# Altium project USB-C Explorer.PrjPcb
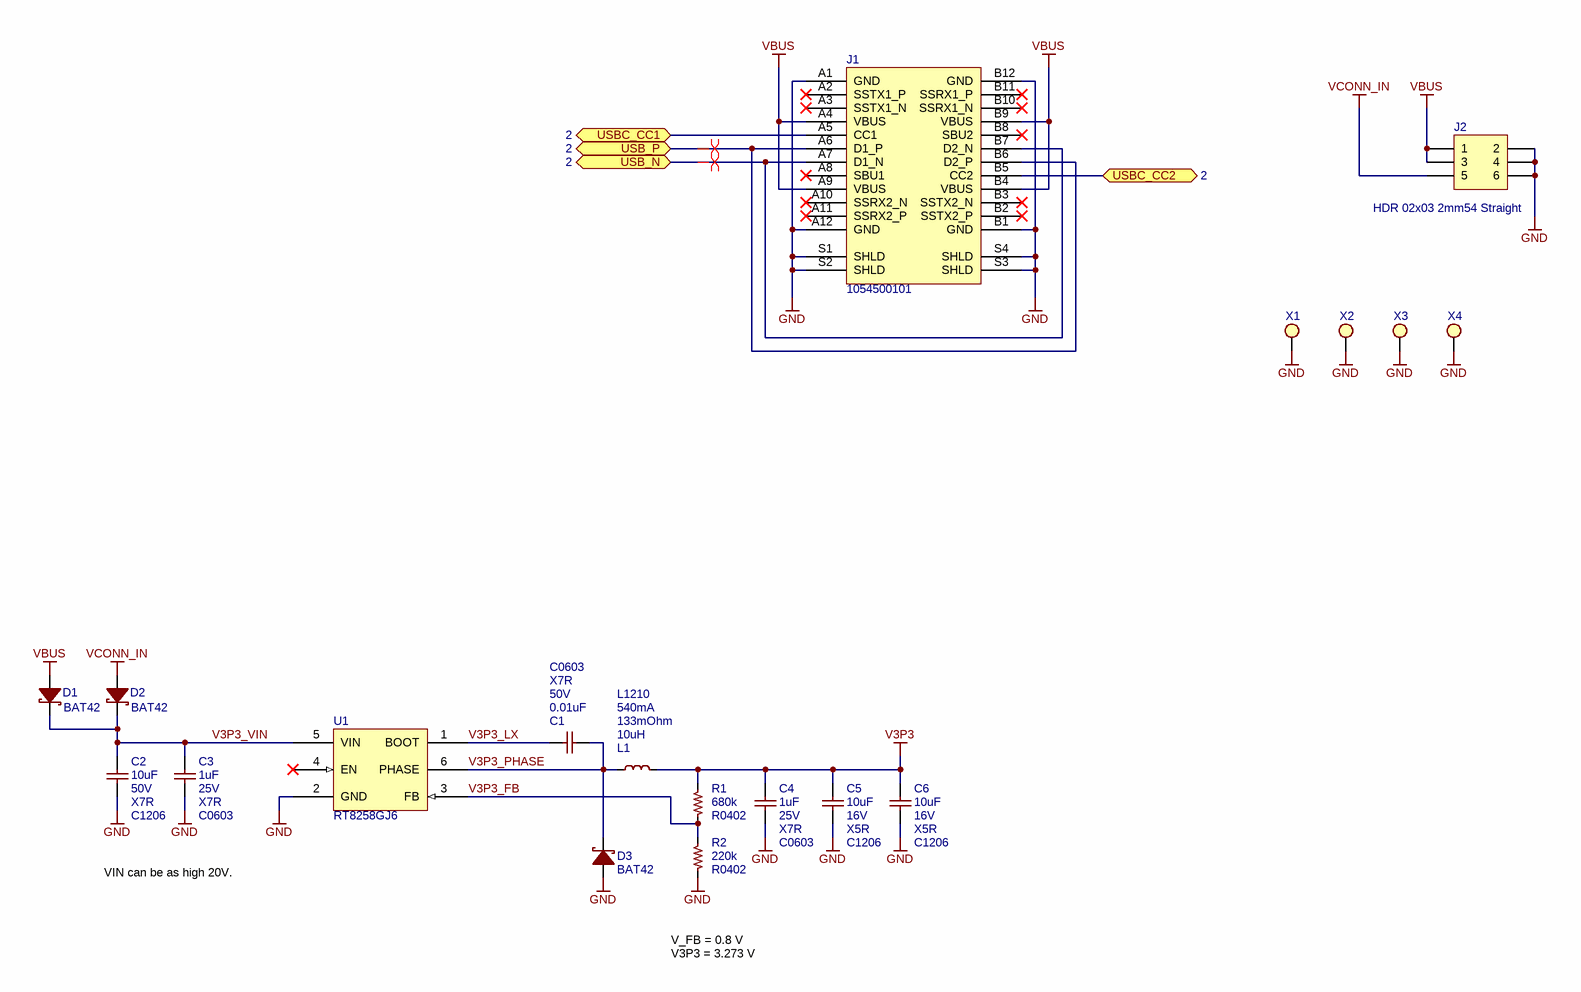
[diagram p0: USB-C.SchDoc]
ProjectDrawnBy: Jason Cerundolo; ProjectFullName: USB-C Explorer; ProjectFullNameNoSpaces: USB-C_Explorer; ProjectName: USB-C Explorer; ProjectRevision: 2
3 sheets, 59 parts. Net scope: flat (ports and power ports of the same name join across sheets).
Board file: USB-C_Explorer.PcbDoc
Sheets:
  USB-C.SchDoc
  MCU.schdoc
  Display.SchDoc

## Sheet USB-C.SchDoc
size B; DocumentFullName: Connectors and Power; Organization: Reclaimer Labs, LLC; Address1: 3652 Beth Ct; Address2: Santa Clara CA 95054; DocumentNumber: 1; SheetNumber: 1; SheetTotal: 3; License: Open Source Hardware - MIT License

### Parts
C1  value 0.01uF  Voltage: 50V  Material: X7R  [C0603]  (hidden comment: MF-CAP-0603-0.01uF)
C2  value 10uF  Voltage: 50V  Material: X7R  [C1206]  (hidden comment: CL31B106KBHNNNE)
C3  value 1uF  Voltage: 25V  Material: X7R  [C0603]  (hidden comment: MF-CAP-0603-1uF)
C4  value 1uF  Voltage: 25V  Material: X7R  [C0603]  (hidden comment: MF-CAP-0603-1uF)
C5  value 10uF  Voltage: 16V  Material: X5R  [C1206]  (hidden comment: MF-CAP-1206-10uF)
C6  value 10uF  Voltage: 16V  Material: X5R  [C1206]  (hidden comment: MF-CAP-1206-10uF)
D1  value BAT42  [SOD-123]  (hidden comment: MF-DIO-SOD123-BAT42)
D2  value BAT42  [SOD-123]  (hidden comment: MF-DIO-SOD123-BAT42)
D3  value BAT42  [SOD-123]  (hidden comment: MF-DIO-SOD123-BAT42)
J1  1054500101  [1054500101]
J2  value HDR 02x03 2mm54 Straight  [CONN_HEADER_02x03_2mm54_Straight]  (hidden comment: MF-CON-2.54mm-2x3)
L1  value 10uH  DCR: 133mOhm  Current: 540mA  [L1210]  (hidden comment: MF-IND-1210-10uH)
R1  value 680k  [R0402]  (hidden comment: MF-RES-0402-680K)
R2  value 220k  [R0402]  (hidden comment: MF-RES-0402-220K)
U1  RT8258GJ6  [SOT23-6]
X1  MTHOLE  (value not drawn)  (no BOM)
X2  MTHOLE  (value not drawn)  (no BOM)
X3  MTHOLE  (value not drawn)  (no BOM)
X4  MTHOLE  (value not drawn)  (no BOM)

### Ports
USB_N (bidir, see 2), USB_P (bidir, see 2), USBC_CC1 (bidir, see 2), USBC_CC2 (bidir, see 2)

### Nets
GND: C2.2(C2) C3.2(C2) C4.2(C2) C5.2(C2) C6.2(C2) D3.2(C2) J1.A1(GND) J1.A12(GND) J1.B1(GND) J1.B12(GND) J1.S1(SHLD) J1.S2(SHLD) J1.S3(SHLD) J1.S4(SHLD) J2.2 J2.4 J2.6 R2.2(R2) U1.2(GND) X1.1 X2.1 X3.1 X4.1
V3P3: C4.1(C1) C5.1(C1) C6.1(C1) L1.2(R2) R1.1(R1)
VBUS: D1.2(C2) J1.A4(VBUS) J1.A9(VBUS) J1.B4(VBUS) J1.B9(VBUS) J2.1 J2.3
VCONN_IN: D2.2(C2) J2.5
USB_N: J1.A7(D1_N) J1.B7(D2_N) ; port USB_N
USB_P: J1.A6(D1_P) J1.B6(D2_P) ; port USB_P
USBC_CC1: J1.A5(CC1) ; port USBC_CC1
USBC_CC2: J1.B5(CC2) ; port USBC_CC2
V3P3_FB: R1.2(R2) R2.1(R1) U1.3(FB)
V3P3_LX: C1.1(C1) U1.1(BOOT)
V3P3_PHASE: C1.2(C2) D3.1(C1) L1.1(R1) U1.6(PHASE)
V3P3_VIN: C2.1(C1) C3.1(C1) D1.1(C1) D2.1(C1) U1.5(VIN)

Not connected (* = marked no-connect by the designer): J1 A2(SSTX1_P)* A3(SSTX1_N)* A8(SBU1)* A10(SSRX2_N)* A11(SSRX2_P)* B2(SSTX2_P)* B3(SSTX2_N)* B8(SBU2)* B10(SSRX1_N)* B11(SSRX1_P)*; U1 4(EN)*

### Layout directives
differential pair: USB_N, USB_P

### Notes on the sheet
- VIN can be as high 20V.
- V_FB = 0.8 V
  V3P3 = 3.273 V
- Project:
- Date:
- Revision:
- Drawn By:
- Document:
- Time:
- Sheet
- of

### Library data of the parts
C1 C3-C6 = CAPACITOR_NP: Manufacturer 1: MacroFab
  C1: Manufacturer Part Number 1: MF-CAP-0603-0.01uF; DisplayFootprint: C0603
  C3 C4: Manufacturer Part Number 1: MF-CAP-0603-1uF; DisplayFootprint: C0603
  C5 C6: Manufacturer Part Number 1: MF-CAP-1206-10uF; DisplayFootprint: C1206
C2 = CAPACITOR_NP: Manufacturer 1: Samsung; Supplier 1: Digi-Key; Supplier Part Number 1: 1276-6767-1-ND; DisplayFootprint: C1206; Manufacturer Part Number 1: CL31B106KBHNNNE
D1 D2 = DIODE_SCHOTTKY: Manufacturer: MacroFab; Manufacturer Part Number 1: MF-DIO-SOD123-BAT42
D3 = DIODE_SCHOTTKY: Manufacturer 1: MacroFab; Manufacturer Part Number 1: MF-DIO-SOD123-BAT42
J1 = USB-C_RECPT: Manufacturer: Molex; Value: 1054500101; Manufacturer Part Number 1: 1054500101
J2 = CONN_HEADER_02x03_2mm54_Straight: Manufacturer 1: MacroFab; Manufacturer Part Number 1: MF-CON-2.54mm-2x3
L1 = INDUCTOR: Manufacturer 1: MacroFab; FootprintDisplay: L1210; Manufacturer Part Number 1: MF-IND-1210-10uH
R1 R2 = RESISTOR: Manufacturer 1: MacroFab; FootprintDisplay: R0402
  R1: Manufacturer Part Number 1: MF-RES-0402-680K
  R2: Manufacturer Part Number 1: MF-RES-0402-220K
U1 = BUCK_RT8258GJ6: Manufacturer 1: Richtek; Value: RT8258GJ6; Supplier 1: Digi-Key; Supplier Part Number 1: 1028-1044-1-ND; Manufacturer Part Number 1: RT8258GJ6

## Sheet MCU.schdoc
size B; DocumentFullName: Microcontroller; Organization: Reclaimer Labs, LLC; Address1: 3652 Beth Ct; Address2: Santa Clara CA 95054; DocumentNumber: 2; SheetNumber: 2; SheetTotal: 3; License: Open Source Hardware - MIT License
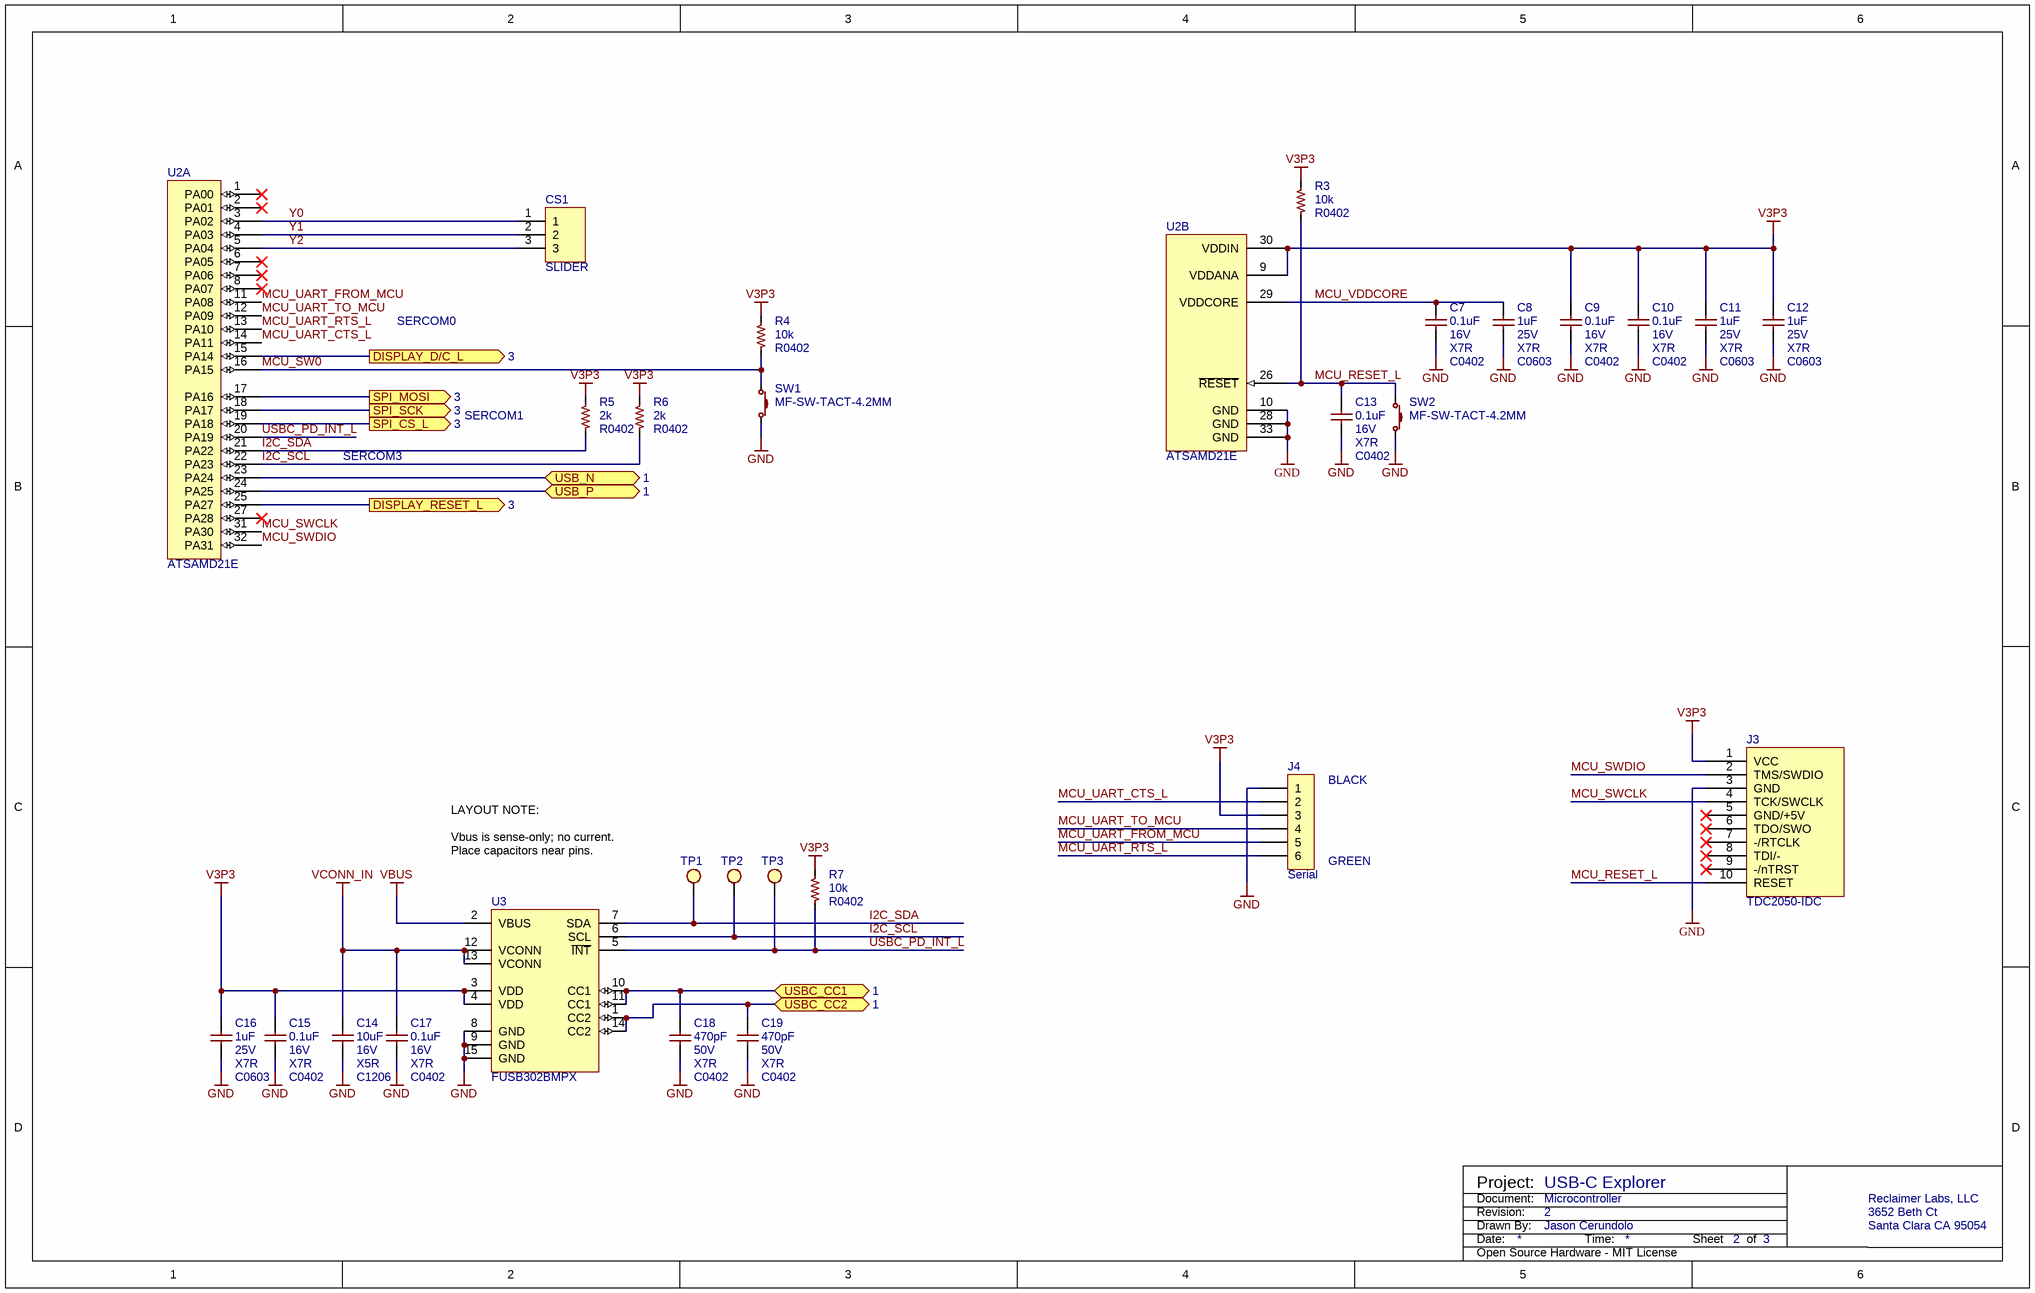
[diagram p1: MCU.schdoc]

### Parts
C7  value 0.1uF  Voltage: 16V  Material: X7R  [C0402]  (hidden comment: MF-CAP-0402-0.1uF)
C8  value 1uF  Voltage: 25V  Material: X7R  [C0603]  (hidden comment: MF-CAP-0603-1uF)
C9  value 0.1uF  Voltage: 16V  Material: X7R  [C0402]  (hidden comment: MF-CAP-0402-0.1uF)
C10  value 0.1uF  Voltage: 16V  Material: X7R  [C0402]  (hidden comment: MF-CAP-0402-0.1uF)
C11  value 1uF  Voltage: 25V  Material: X7R  [C0603]  (hidden comment: MF-CAP-0603-1uF)
C12  value 1uF  Voltage: 25V  Material: X7R  [C0603]  (hidden comment: MF-CAP-0603-1uF)
C13  value 0.1uF  Voltage: 16V  Material: X7R  [C0402]  (hidden comment: MF-CAP-0402-0.1uF)
C14  value 10uF  Voltage: 16V  Material: X5R  [C1206]  (hidden comment: MF-CAP-1206-10uF)
C15  value 0.1uF  Voltage: 16V  Material: X7R  [C0402]  (hidden comment: MF-CAP-0402-0.1uF)
C16  value 1uF  Voltage: 25V  Material: X7R  [C0603]  (hidden comment: MF-CAP-0603-1uF)
C17  value 0.1uF  Voltage: 16V  Material: X7R  [C0402]  (hidden comment: MF-CAP-0402-0.1uF)
C18  value 470pF  Voltage: 50V  Material: X7R  [C0402]  (hidden comment: CL05B471KB5NNNC)
C19  value 470pF  Voltage: 50V  Material: X7R  [C0402]  (hidden comment: CL05B471KB5NNNC)
CS1  SLIDER  [QTOUCH_SLIDER_19x6mm]  (no BOM)
J3  value TDC2050-IDC  [TC2050-IDC-NL]  (hidden comment: DNP)  (no BOM)
J4  value Serial  [CONN_HEADER_01x06_2mm54_Straight]  (hidden comment: DNP)
R3  value 10k  [R0402]  (hidden comment: MF-RES-0402-10K)
R4  value 10k  [R0402]  (hidden comment: MF-RES-0402-10K)
R5  value 2k  [R0402]  (hidden comment: MF-RES-0402-2K)
R6  value 2k  [R0402]  (hidden comment: MF-RES-0402-2K)
R7  value 10k  [R0402]  (hidden comment: MF-RES-0402-10K)
SW1  MF-SW-TACT-4.2MM  [TACT_4.2MM]
SW2  MF-SW-TACT-4.2MM  [TACT_4.2MM]
TP1  TESTPOINT  [TP_1mm]  (value not drawn)  (no BOM)
TP2  TESTPOINT  [TP_1mm]  (value not drawn)  (no BOM)
TP3  TESTPOINT  [TP_1mm]  (value not drawn)  (no BOM)
U2  value ATSAMD21E  [QFN32EP]  (hidden comment: ATSAMD21E17A-MU)  (parts A,B of 2)
U3  FUSB302BMPX  [MLP14]

### Ports
DISPLAY_D/C_L (out, see 3), DISPLAY_RESET_L (out, see 3), SPI_CS_L (out, see 3), SPI_MOSI (out, see 3), SPI_SCK (out, see 3), USB_N (bidir, see 1), USB_P (bidir, see 1), USBC_CC1 (bidir, see 1), USBC_CC2 (bidir, see 1)

### Nets
GND: C7.2(C2) C8.2(C2) C9.2(C2) C10.2(C2) C11.2(C2) C12.2(C2) C13.2(C2) C14.2(C2) C15.2(C2) C16.2(C2) C17.2(C2) C18.2(C2) C19.2(C2) J3.3(GND) J4.1 SW1.2 SW2.2 U2.10(GND) U2.28(GND) U2.33(GND) U3.8(GND) U3.9(GND) U3.15(GND)
V3P3: C9.1(C1) C10.1(C1) C11.1(C1) C12.1(C1) C15.1(C1) C16.1(C1) J3.1(VCC) J4.3 R3.1(R1) R4.1(R1) R5.1(R1) R6.1(R1) R7.1(R1) U2.9(VDDANA) U2.30(VDDIN) U3.3(VDD) U3.4(VDD)
VBUS: U3.2(VBUS)
VCONN_IN: C14.1(C1) C17.1(C1) U3.12(VCONN) U3.13(VCONN)
DISPLAY_D/C_L: U2.15(PA14) ; port DISPLAY_D/C_L
DISPLAY_RESET_L: U2.25(PA27) ; port DISPLAY_RESET_L
I2C_SCL: R6.2(R2) TP2.1 U2.22(PA23) U3.6(SCL)
I2C_SDA: R5.2(R2) TP1.1 U2.21(PA22) U3.7(SDA)
MCU_RESET_L: C13.1(C1) J3.10(RESET) R3.2(R2) SW2.1 U2.26(~{RESET})
MCU_SW0: R4.2(R2) SW1.1 U2.16(PA15)
MCU_SWCLK: J3.4(TCK/SWCLK) U2.31(PA30)
MCU_SWDIO: J3.2(TMS/SWDIO) U2.32(PA31)
MCU_UART_CTS_L: J4.2 U2.14(PA11)
MCU_UART_FROM_MCU: J4.5 U2.11(PA08)
MCU_UART_RTS_L: J4.6 U2.13(PA10)
MCU_UART_TO_MCU: J4.4 U2.12(PA09)
MCU_VDDCORE: C7.1(C1) C8.1(C1) U2.29(VDDCORE)
SPI_CS_L: U2.19(PA18) ; port SPI_CS_L
SPI_MOSI: U2.17(PA16) ; port SPI_MOSI
SPI_SCK: U2.18(PA17) ; port SPI_SCK
USB_N: U2.23(PA24) ; port USB_N
USB_P: U2.24(PA25) ; port USB_P
USBC_CC1: C18.1(C1) U3.10(CC1) U3.11(CC1) ; port USBC_CC1
USBC_CC2: C19.1(C1) U3.1(CC2) U3.14(CC2) ; port USBC_CC2
USBC_PD_INT_L: R7.2(R2) TP3.1 U2.20(PA19) U3.5(~{INT})
Y0: CS1.1 U2.3(PA02)
Y1: CS1.2 U2.4(PA03)
Y2: CS1.3 U2.5(PA04)

Not connected (* = marked no-connect by the designer): J3 5(GND/+5V)* 6(TDO/SWO)* 7(-/RTCLK)* 8(TDI/-)* 9(-/nTRST)*; U2 1(PA00)* 2(PA01)* 6(PA05)* 7(PA06)* 8(PA07)* 27(PA28)*

### Notes on the sheet
- SERCOM0
- SERCOM1
- SERCOM3
- (near J4) BLACK
- LAYOUT NOTE:
  Vbus is sense-only; no current.
  Place capacitors near pins.
- (near J4) GREEN
- Project:
- Date:
- Revision:
- Drawn By:
- Document:
- Time:
- Sheet
- of

### Library data of the parts
C7-C17 = CAPACITOR_NP: Manufacturer 1: MacroFab
  C7 C9 C10 C13 C15 C17: Manufacturer Part Number 1: MF-CAP-0402-0.1uF; DisplayFootprint: C0402
  C8 C11 C12 C16: Manufacturer Part Number 1: MF-CAP-0603-1uF; DisplayFootprint: C0603
  C14: Manufacturer Part Number 1: MF-CAP-1206-10uF; DisplayFootprint: C1206
C18 C19 = CAPACITOR_NP: Manufacturer 1: Samsung; Supplier 1: Digi-Key; Supplier Part Number 1: 1276-1566-1-ND; Manufacturer Part Number 1: CL05B471KB5NNNC; DisplayFootprint: C0402
CS1 = QTOUCH_SLIDER
J3 = TC2050-IDC: Manufacturer Part Number 1: DNP
J4 = CONN_HEADER_01x06_2mm54_Straight: Manufacturer Part Number 1: DNP
R3-R7 = RESISTOR: Manufacturer 1: MacroFab; FootprintDisplay: R0402
  R3 R4 R7: Manufacturer Part Number 1: MF-RES-0402-10K
  R5 R6: Manufacturer Part Number 1: MF-RES-0402-2K
SW1 SW2 = SW_SPST_PB: Manufacturer 1: MacroFab; Value: Push Button; Manufacturer Part Number 1: MF-SW-TACT-4.2MM
U2 = ATSAMD21E: Manufacturer 1: Microchip; Manufacturer Part Number 1: ATSAMD21E17A-MU
U3 = FUSB302B: Manufacturer 1: Fairchild/ON; Value: FUSB302BMPX; Supplier 1: Digi-Key; Supplier Part Number 1: FUSB302BMPXCT-ND; Manufacturer Part Number 1: FUSB302BMPX

## Sheet Display.SchDoc
size B; Organization: Reclaimer Labs, LLC; Address1: 3652 Beth Ct; Address2: Santa Clara CA 95054; DocumentNumber: 3; SheetNumber: 3; SheetTotal: 3; License: Open Source Hardware - MIT License; DocumentFullName: Display
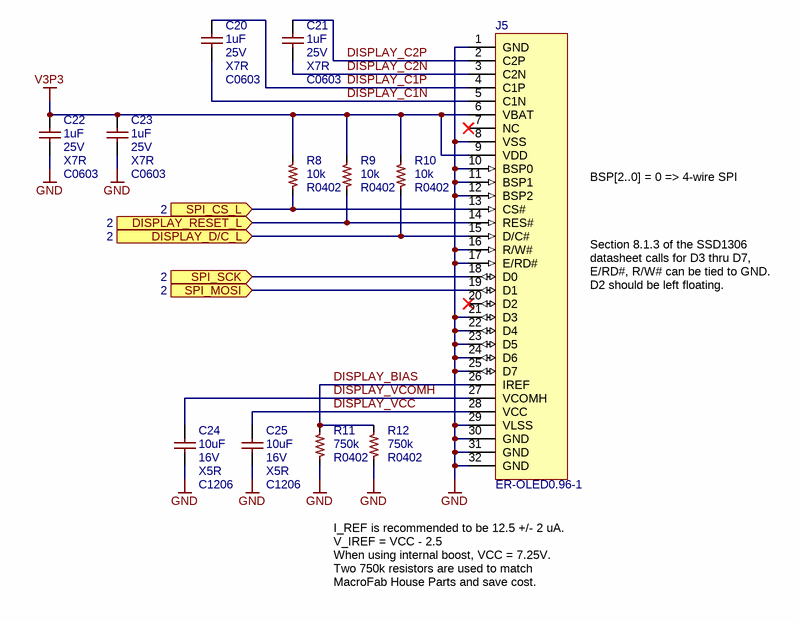
[diagram p2: Display.SchDoc]

### Parts
C20  value 1uF  Voltage: 25V  Material: X7R  [C0603]  (hidden comment: MF-CAP-0603-1uF)
C21  value 1uF  Voltage: 25V  Material: X7R  [C0603]  (hidden comment: MF-CAP-0603-1uF)
C22  value 1uF  Voltage: 25V  Material: X7R  [C0603]  (hidden comment: MF-CAP-0603-1uF)
C23  value 1uF  Voltage: 25V  Material: X7R  [C0603]  (hidden comment: MF-CAP-0603-1uF)
C24  value 10uF  Voltage: 16V  Material: X5R  [C1206]  (hidden comment: MF-CAP-1206-10uF)
C25  value 10uF  Voltage: 16V  Material: X5R  [C1206]  (hidden comment: MF-CAP-1206-10uF)
J5  value ER-OLED0.96-1  [SFV30R_Mirrored]  (hidden comment: SFV30R-3STBE1HLF)
R8  value 10k  [R0402]  (hidden comment: MF-RES-0402-10K)
R9  value 10k  [R0402]  (hidden comment: MF-RES-0402-10K)
R10  value 10k  [R0402]  (hidden comment: MF-RES-0402-10K)
R11  value 750k  [R0402]  (hidden comment: MF-RES-0402-750K)
R12  value 750k  [R0402]  (hidden comment: MF-RES-0402-750K)

### Ports
DISPLAY_D/C_L (in, see 2), DISPLAY_RESET_L (in, see 2), SPI_CS_L (in, see 2), SPI_MOSI (in, see 2), SPI_SCK (in, see 2)

### Nets
GND: C22.2(C2) C23.2(C2) C24.2(C2) C25.2(C2) J5.1(GND) J5.8(VSS) J5.10(BSP0) J5.11(BSP1) J5.12(BSP2) J5.16(R/W#) J5.17(E/RD#) J5.21(D3) J5.22(D4) J5.23(D5) J5.24(D6) J5.25(D7) J5.29(VLSS) J5.30(GND) J5.31(GND) J5.32(GND) R11.2(R2) R12.2(R2)
V3P3: C22.1(C1) C23.1(C1) J5.6(VBAT) J5.9(VDD) R8.1(R1) R9.1(R1) R10.1(R1)
DISPLAY_BIAS: J5.26(IREF) R11.1(R1) R12.1(R1)
DISPLAY_C1N: C20.2(C2) J5.5(C1N)
DISPLAY_C1P: C20.1(C1) J5.4(C1P)
DISPLAY_C2N: C21.2(C2) J5.3(C2N)
DISPLAY_C2P: C21.1(C1) J5.2(C2P)
DISPLAY_D/C_L: J5.15(D/C#) R10.2(R2) ; port DISPLAY_D/C_L
DISPLAY_RESET_L: J5.14(RES#) R9.2(R2) ; port DISPLAY_RESET_L
DISPLAY_VCC: C25.1(C1) J5.28(VCC)
DISPLAY_VCOMH: C24.1(C1) J5.27(VCOMH)
SPI_CS_L: J5.13(CS#) R8.2(R2) ; port SPI_CS_L
SPI_MOSI: J5.19(D1) ; port SPI_MOSI
SPI_SCK: J5.18(D0) ; port SPI_SCK

Not connected (* = marked no-connect by the designer): J5 7(NC)* 20(D2)*

### Notes on the sheet
- BSP[2..0] = 0 => 4-wire SPI
- Section 8.1.3 of the SSD1306 datasheet calls for D3 thru D7, E/RD#, R/W# can be tied to GND.
  D2 should be left floating.
- I_REF is recommended to be 12.5 +/- 2 uA.
  V_IREF = VCC - 2.5
  When using internal boost, VCC = 7.25V.
  Two 750k resistors are used to match MacroFab House Parts and save cost.
- Project:
- Date:
- Revision:
- Drawn By:
- Document:
- Time:
- Sheet
- of

### Library data of the parts
C20-C25 = CAPACITOR_NP: Manufacturer 1: MacroFab
  C20-C23: Manufacturer Part Number 1: MF-CAP-0603-1uF; DisplayFootprint: C0603
  C24 C25: Manufacturer Part Number 1: MF-CAP-1206-10uF; DisplayFootprint: C1206
J5 = ER-OLED0.96-1: Manufacturer 1: Amphenol FCI; Manufacturer Part Number 1: SFV30R-3STBE1HLF
R8-R12 = RESISTOR: Manufacturer 1: MacroFab; FootprintDisplay: R0402
  R8-R10: Manufacturer Part Number 1: MF-RES-0402-10K
  R11 R12: Manufacturer Part Number 1: MF-RES-0402-750K

## Nets that join several sheets
GND: USB-C (23 pins), MCU (23 pins), Display (22 pins)
V3P3: USB-C (5 pins), MCU (17 pins), Display (7 pins)
VBUS: USB-C (7 pins), MCU (U3.2)
VCONN_IN: USB-C (D2.2 J2.5), MCU (C14.1 C17.1 U3.12 U3.13)
DISPLAY_D/C_L: MCU (U2.15), Display (J5.15 R10.2)
DISPLAY_RESET_L: MCU (U2.25), Display (J5.14 R9.2)
SPI_CS_L: MCU (U2.19), Display (J5.13 R8.2)
SPI_MOSI: MCU (U2.17), Display (J5.19)
SPI_SCK: MCU (U2.18), Display (J5.18)
USB_N: USB-C (J1.A7 J1.B7), MCU (U2.23)
USB_P: USB-C (J1.A6 J1.B6), MCU (U2.24)
USBC_CC1: USB-C (J1.A5), MCU (C18.1 U3.10 U3.11)
USBC_CC2: USB-C (J1.B5), MCU (C19.1 U3.1 U3.14)